# Altium schematic sheet Sheet1.SchDoc
size A; SheetNumber: 1; SheetTotal: 2
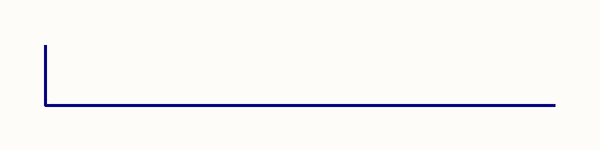
[diagram p0: Sheet1.SchDoc]